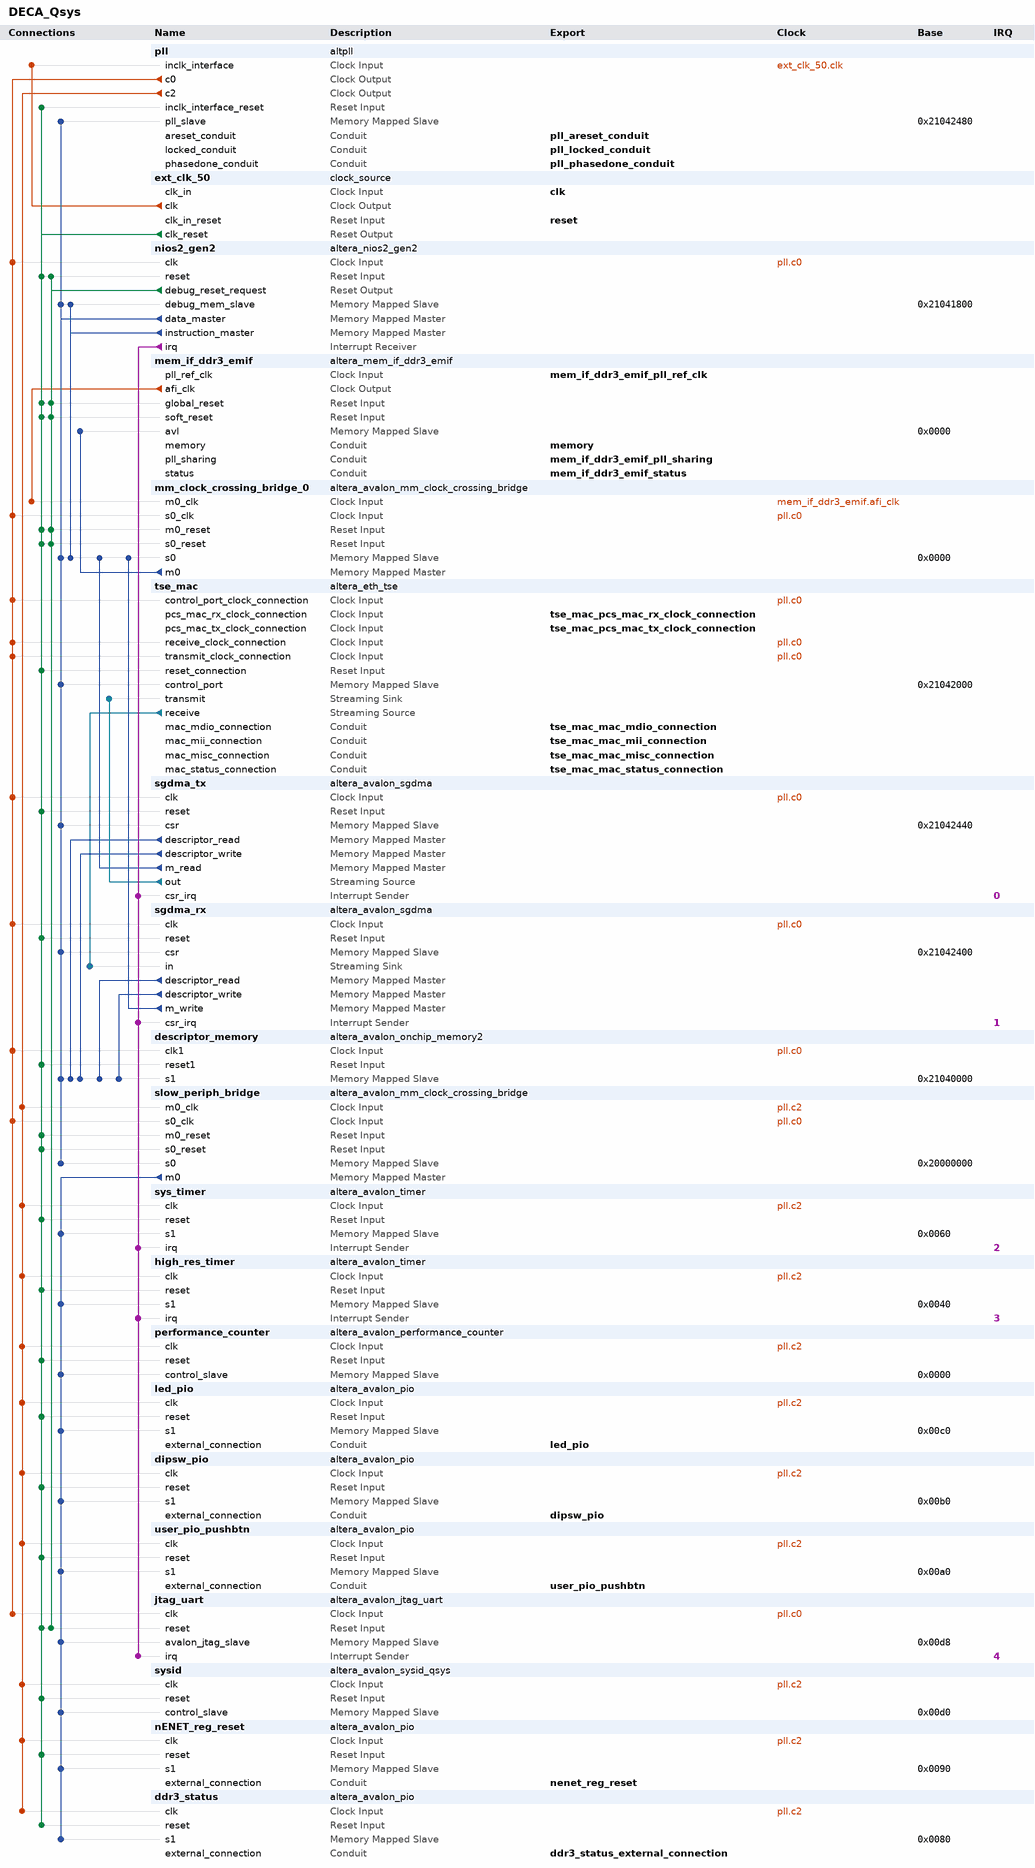
[diagram p0: system contents]
# Platform Designer (Qsys) system DECA_Qsys, MAX 10 10M50DAF484C6GES
# Parameters at their usual value, and those the tool derives, are not listed.
package require -exact qsys 15.0
create_system DECA_Qsys
set_project_property DEVICE_FAMILY {MAX 10}
set_project_property DEVICE 10M50DAF484C6GES

add_instance pll altpll 15.0
set_instance_parameter_value pll CLK0_DIVIDE_BY 1
set_instance_parameter_value pll CLK0_MULTIPLY_BY 2
set_instance_parameter_value pll CLK1_DIVIDE_BY 5
set_instance_parameter_value pll CLK1_DUTY_CYCLE 50
set_instance_parameter_value pll CLK1_MULTIPLY_BY 6
set_instance_parameter_value pll CLK1_PHASE_SHIFT 0
set_instance_parameter_value pll CLK2_DIVIDE_BY 5
set_instance_parameter_value pll CLK2_DUTY_CYCLE 50
set_instance_parameter_value pll CLK2_MULTIPLY_BY 4
set_instance_parameter_value pll CLK2_PHASE_SHIFT 0
set_instance_parameter_value pll CLK3_DIVIDE_BY 2
set_instance_parameter_value pll CLK3_DUTY_CYCLE 50
set_instance_parameter_value pll CLK3_MULTIPLY_BY 1
set_instance_parameter_value pll CLK3_PHASE_SHIFT 0
set_instance_parameter_value pll INCLK0_INPUT_FREQUENCY 20000
set_instance_parameter_value pll PORT_ARESET PORT_USED
set_instance_parameter_value pll PORT_LOCKED PORT_USED
set_instance_parameter_value pll PORT_clk1 PORT_USED
set_instance_parameter_value pll PORT_clk2 PORT_USED
set_instance_parameter_value pll PORT_clk3 PORT_USED

add_instance ext_clk_50 clock_source 15.0
set_instance_parameter_value ext_clk_50 clockFrequency 50000000
set_instance_parameter_value ext_clk_50 resetSynchronousEdges BOTH

add_instance nios2_gen2 altera_nios2_gen2 15.0
set_instance_parameter_value nios2_gen2 dcache_size 2048
set_instance_parameter_value nios2_gen2 exceptionSlave mem_if_ddr3_emif.avl
set_instance_parameter_value nios2_gen2 icache_size 4096
set_instance_parameter_value nios2_gen2 impl Fast
set_instance_parameter_value nios2_gen2 resetSlave mem_if_ddr3_emif.avl

add_instance mem_if_ddr3_emif altera_mem_if_ddr3_emif 15.0
set_instance_parameter_value mem_if_ddr3_emif AVL_MAX_SIZE 4
set_instance_parameter_value mem_if_ddr3_emif CALIBRATION_MODE Skip
set_instance_parameter_value mem_if_ddr3_emif CPORT_TYPE_PORT Bidirectional,Bidirectional,Bidirectional,Bidirectional,Bidirectional,Bidirectional
set_instance_parameter_value mem_if_ddr3_emif EXPORT_AFI_HALF_CLK false
set_instance_parameter_value mem_if_ddr3_emif HARD_EMIF false
set_instance_parameter_value mem_if_ddr3_emif MEM_BANKADDR_WIDTH 3
set_instance_parameter_value mem_if_ddr3_emif MEM_CLK_FREQ 300.0
set_instance_parameter_value mem_if_ddr3_emif MEM_CLK_FREQ_MAX 800.0
set_instance_parameter_value mem_if_ddr3_emif MEM_COL_ADDR_WIDTH 10
set_instance_parameter_value mem_if_ddr3_emif MEM_DQ_WIDTH 16
set_instance_parameter_value mem_if_ddr3_emif MEM_FORMAT DISCRETE
set_instance_parameter_value mem_if_ddr3_emif MEM_ROW_ADDR_WIDTH 15
set_instance_parameter_value mem_if_ddr3_emif MEM_TCL 7
set_instance_parameter_value mem_if_ddr3_emif MEM_TFAW_NS 45.0
set_instance_parameter_value mem_if_ddr3_emif MEM_TRAS_NS 35.0
set_instance_parameter_value mem_if_ddr3_emif MEM_TRCD_NS 13.75
set_instance_parameter_value mem_if_ddr3_emif MEM_TRFC_NS 260.0
set_instance_parameter_value mem_if_ddr3_emif MEM_TRP_NS 13.75
set_instance_parameter_value mem_if_ddr3_emif MEM_TRRD_NS 7.5
set_instance_parameter_value mem_if_ddr3_emif MEM_TRTP_NS 7.5
set_instance_parameter_value mem_if_ddr3_emif MEM_TWTR 6
set_instance_parameter_value mem_if_ddr3_emif MEM_VENDOR Micron
set_instance_parameter_value mem_if_ddr3_emif MEM_WTCL 6
set_instance_parameter_value mem_if_ddr3_emif PLL_LOCATION Top_Bottom
set_instance_parameter_value mem_if_ddr3_emif POWER_OF_TWO_BUS true
set_instance_parameter_value mem_if_ddr3_emif PRIORITY_PORT 1,1,1,1,1,1
set_instance_parameter_value mem_if_ddr3_emif RATE Half
set_instance_parameter_value mem_if_ddr3_emif REF_CLK_FREQ 50.0
set_instance_parameter_value mem_if_ddr3_emif SPEED_GRADE 6
set_instance_parameter_value mem_if_ddr3_emif TIMING_BOARD_AC_SKEW 0.017
set_instance_parameter_value mem_if_ddr3_emif TIMING_BOARD_AC_TO_CK_SKEW -1.3E-4
set_instance_parameter_value mem_if_ddr3_emif TIMING_BOARD_DQ_TO_DQS_SKEW -6.0E-4
set_instance_parameter_value mem_if_ddr3_emif TIMING_BOARD_MAX_CK_DELAY 0.183
set_instance_parameter_value mem_if_ddr3_emif TIMING_BOARD_MAX_DQS_DELAY 0.181
set_instance_parameter_value mem_if_ddr3_emif TIMING_BOARD_SKEW_BETWEEN_DQS 0.005
set_instance_parameter_value mem_if_ddr3_emif TIMING_BOARD_SKEW_CKDQS_DIMM_MAX 0.007
set_instance_parameter_value mem_if_ddr3_emif TIMING_BOARD_SKEW_CKDQS_DIMM_MIN 0.002
set_instance_parameter_value mem_if_ddr3_emif TIMING_BOARD_SKEW_WITHIN_DQS 0.008
set_instance_parameter_value mem_if_ddr3_emif TIMING_TDH 55
set_instance_parameter_value mem_if_ddr3_emif TIMING_TDQSCK 225
set_instance_parameter_value mem_if_ddr3_emif TIMING_TDQSQ 125
set_instance_parameter_value mem_if_ddr3_emif TIMING_TDQSS 0.25
set_instance_parameter_value mem_if_ddr3_emif TIMING_TDS 55
set_instance_parameter_value mem_if_ddr3_emif TIMING_TDSH 0.2
set_instance_parameter_value mem_if_ddr3_emif TIMING_TDSS 0.2
set_instance_parameter_value mem_if_ddr3_emif TIMING_TIH 130
set_instance_parameter_value mem_if_ddr3_emif TIMING_TIS 185
set_instance_parameter_value mem_if_ddr3_emif TIMING_TQSH 0.4
set_instance_parameter_value mem_if_ddr3_emif USER_DEBUG_LEVEL 1

add_instance mm_clock_crossing_bridge_0 altera_avalon_mm_clock_crossing_bridge 15.0
set_instance_parameter_value mm_clock_crossing_bridge_0 ADDRESS_WIDTH 10
set_instance_parameter_value mm_clock_crossing_bridge_0 COMMAND_FIFO_DEPTH 16
set_instance_parameter_value mm_clock_crossing_bridge_0 DATA_WIDTH 32
set_instance_parameter_value mm_clock_crossing_bridge_0 MASTER_SYNC_DEPTH 2
set_instance_parameter_value mm_clock_crossing_bridge_0 MAX_BURST_SIZE 1
set_instance_parameter_value mm_clock_crossing_bridge_0 RESPONSE_FIFO_DEPTH 16
set_instance_parameter_value mm_clock_crossing_bridge_0 SLAVE_SYNC_DEPTH 2
set_instance_parameter_value mm_clock_crossing_bridge_0 USE_AUTO_ADDRESS_WIDTH 1

add_instance tse_mac altera_eth_tse 15.0
set_instance_parameter_value tse_mac core_variation SMALL_MAC_10_100
set_instance_parameter_value tse_mac enable_hd_logic true
set_instance_parameter_value tse_mac enable_mac_flow_ctrl false
set_instance_parameter_value tse_mac enable_magic_detect false
set_instance_parameter_value tse_mac enable_shift16 true
set_instance_parameter_value tse_mac ifGMII MII
set_instance_parameter_value tse_mac ing_addr 11
set_instance_parameter_value tse_mac mdio_clk_div 40
set_instance_parameter_value tse_mac stat_cnt_ena false
set_instance_parameter_value tse_mac transceiver_type NONE

add_instance sgdma_tx altera_avalon_sgdma 15.0
set_instance_parameter_value sgdma_tx enableBurstTransfers false
set_instance_parameter_value sgdma_tx enableUnalignedTransfers false
set_instance_parameter_value sgdma_tx readBlockDataWidth 32
set_instance_parameter_value sgdma_tx sinkErrorWidth 0
set_instance_parameter_value sgdma_tx sourceErrorWidth 1
set_instance_parameter_value sgdma_tx transferMode MEMORY_TO_STREAM
set_instance_parameter_value sgdma_tx writeBurstcountWidth 4

add_instance sgdma_rx altera_avalon_sgdma 15.0
set_instance_parameter_value sgdma_rx enableBurstTransfers false
set_instance_parameter_value sgdma_rx enableUnalignedTransfers false
set_instance_parameter_value sgdma_rx readBlockDataWidth 32
set_instance_parameter_value sgdma_rx sinkErrorWidth 6
set_instance_parameter_value sgdma_rx sourceErrorWidth 0
set_instance_parameter_value sgdma_rx transferMode STREAM_TO_MEMORY
set_instance_parameter_value sgdma_rx writeBurstcountWidth 4

add_instance descriptor_memory altera_avalon_onchip_memory2 15.0
set_instance_parameter_value descriptor_memory dataWidth 32
set_instance_parameter_value descriptor_memory dualPort false
set_instance_parameter_value descriptor_memory initMemContent false
set_instance_parameter_value descriptor_memory initializationFileName descriptor_memory
set_instance_parameter_value descriptor_memory memorySize 4096

add_instance slow_periph_bridge altera_avalon_mm_clock_crossing_bridge 15.0
set_instance_parameter_value slow_periph_bridge ADDRESS_WIDTH 10
set_instance_parameter_value slow_periph_bridge COMMAND_FIFO_DEPTH 4
set_instance_parameter_value slow_periph_bridge DATA_WIDTH 32
set_instance_parameter_value slow_periph_bridge MASTER_SYNC_DEPTH 2
set_instance_parameter_value slow_periph_bridge MAX_BURST_SIZE 1
set_instance_parameter_value slow_periph_bridge RESPONSE_FIFO_DEPTH 4
set_instance_parameter_value slow_periph_bridge SLAVE_SYNC_DEPTH 2
set_instance_parameter_value slow_periph_bridge USE_AUTO_ADDRESS_WIDTH 0

add_instance sys_timer altera_avalon_timer 15.0
set_instance_parameter_value sys_timer period 10
set_instance_parameter_value sys_timer periodUnits MSEC

add_instance high_res_timer altera_avalon_timer 15.0
set_instance_parameter_value high_res_timer period 1
set_instance_parameter_value high_res_timer periodUnits USEC

add_instance performance_counter altera_avalon_performance_counter 15.0
set_instance_parameter_value performance_counter numberOfSections 3

add_instance led_pio altera_avalon_pio 15.0
set_instance_parameter_value led_pio direction Output
set_instance_parameter_value led_pio width 8

add_instance dipsw_pio altera_avalon_pio 15.0
set_instance_parameter_value dipsw_pio captureEdge true
set_instance_parameter_value dipsw_pio direction Input
set_instance_parameter_value dipsw_pio edgeType ANY
set_instance_parameter_value dipsw_pio simDoTestBenchWiring true
set_instance_parameter_value dipsw_pio simDrivenValue 3
set_instance_parameter_value dipsw_pio width 2

add_instance user_pio_pushbtn altera_avalon_pio 15.0
set_instance_parameter_value user_pio_pushbtn direction Input
set_instance_parameter_value user_pio_pushbtn edgeType FALLING
set_instance_parameter_value user_pio_pushbtn simDoTestBenchWiring true
set_instance_parameter_value user_pio_pushbtn simDrivenValue 1
set_instance_parameter_value user_pio_pushbtn width 1

add_instance jtag_uart altera_avalon_jtag_uart 15.0
set_instance_parameter_value jtag_uart simInteractiveOptions INTERACTIVE_ASCII_OUTPUT

add_instance sysid altera_avalon_sysid_qsys 15.0
set_instance_parameter_value sysid id 0

add_instance nENET_reg_reset altera_avalon_pio 15.0
set_instance_parameter_value nENET_reg_reset direction Output
set_instance_parameter_value nENET_reg_reset resetValue 1
set_instance_parameter_value nENET_reg_reset width 1

add_instance ddr3_status altera_avalon_pio 15.0
set_instance_parameter_value ddr3_status direction Input
set_instance_parameter_value ddr3_status width 3

# connections
add_connection ext_clk_50.clk pll.inclk_interface clock
add_connection mem_if_ddr3_emif.afi_clk mm_clock_crossing_bridge_0.m0_clk clock
add_connection pll.c0 descriptor_memory.clk1 clock
add_connection pll.c0 jtag_uart.clk clock
add_connection pll.c0 mm_clock_crossing_bridge_0.s0_clk clock
add_connection pll.c0 nios2_gen2.clk clock
add_connection pll.c0 sgdma_rx.clk clock
add_connection pll.c0 sgdma_tx.clk clock
add_connection pll.c0 slow_periph_bridge.s0_clk clock
add_connection pll.c0 tse_mac.control_port_clock_connection clock
add_connection pll.c0 tse_mac.receive_clock_connection clock
add_connection pll.c0 tse_mac.transmit_clock_connection clock
add_connection pll.c2 ddr3_status.clk clock
add_connection pll.c2 dipsw_pio.clk clock
add_connection pll.c2 high_res_timer.clk clock
add_connection pll.c2 led_pio.clk clock
add_connection pll.c2 nENET_reg_reset.clk clock
add_connection pll.c2 performance_counter.clk clock
add_connection pll.c2 slow_periph_bridge.m0_clk clock
add_connection pll.c2 sys_timer.clk clock
add_connection pll.c2 sysid.clk clock
add_connection pll.c2 user_pio_pushbtn.clk clock
add_connection ext_clk_50.clk_reset ddr3_status.reset reset
add_connection ext_clk_50.clk_reset descriptor_memory.reset1 reset
add_connection ext_clk_50.clk_reset dipsw_pio.reset reset
add_connection ext_clk_50.clk_reset high_res_timer.reset reset
add_connection ext_clk_50.clk_reset jtag_uart.reset reset
add_connection ext_clk_50.clk_reset led_pio.reset reset
add_connection ext_clk_50.clk_reset mem_if_ddr3_emif.global_reset reset
add_connection ext_clk_50.clk_reset mem_if_ddr3_emif.soft_reset reset
add_connection ext_clk_50.clk_reset mm_clock_crossing_bridge_0.m0_reset reset
add_connection ext_clk_50.clk_reset mm_clock_crossing_bridge_0.s0_reset reset
add_connection ext_clk_50.clk_reset nENET_reg_reset.reset reset
add_connection ext_clk_50.clk_reset nios2_gen2.reset reset
add_connection ext_clk_50.clk_reset performance_counter.reset reset
add_connection ext_clk_50.clk_reset pll.inclk_interface_reset reset
add_connection ext_clk_50.clk_reset sgdma_rx.reset reset
add_connection ext_clk_50.clk_reset sgdma_tx.reset reset
add_connection ext_clk_50.clk_reset slow_periph_bridge.m0_reset reset
add_connection ext_clk_50.clk_reset slow_periph_bridge.s0_reset reset
add_connection ext_clk_50.clk_reset sys_timer.reset reset
add_connection ext_clk_50.clk_reset sysid.reset reset
add_connection ext_clk_50.clk_reset tse_mac.reset_connection reset
add_connection ext_clk_50.clk_reset user_pio_pushbtn.reset reset
add_connection nios2_gen2.debug_reset_request jtag_uart.reset reset
add_connection nios2_gen2.debug_reset_request mem_if_ddr3_emif.global_reset reset
add_connection nios2_gen2.debug_reset_request mem_if_ddr3_emif.soft_reset reset
add_connection nios2_gen2.debug_reset_request mm_clock_crossing_bridge_0.m0_reset reset
add_connection nios2_gen2.debug_reset_request mm_clock_crossing_bridge_0.s0_reset reset
add_connection nios2_gen2.debug_reset_request nios2_gen2.reset reset
add_connection mm_clock_crossing_bridge_0.m0 mem_if_ddr3_emif.avl avalon
set_connection_parameter_value mm_clock_crossing_bridge_0.m0/mem_if_ddr3_emif.avl baseAddress 0x0000
add_connection nios2_gen2.data_master descriptor_memory.s1 avalon
set_connection_parameter_value nios2_gen2.data_master/descriptor_memory.s1 baseAddress 0x21040000
add_connection nios2_gen2.data_master mm_clock_crossing_bridge_0.s0 avalon
set_connection_parameter_value nios2_gen2.data_master/mm_clock_crossing_bridge_0.s0 baseAddress 0x0000
add_connection nios2_gen2.data_master nios2_gen2.debug_mem_slave avalon
set_connection_parameter_value nios2_gen2.data_master/nios2_gen2.debug_mem_slave baseAddress 0x21041800
add_connection nios2_gen2.data_master pll.pll_slave avalon
set_connection_parameter_value nios2_gen2.data_master/pll.pll_slave baseAddress 0x21042480
add_connection nios2_gen2.data_master sgdma_rx.csr avalon
set_connection_parameter_value nios2_gen2.data_master/sgdma_rx.csr baseAddress 0x21042400
add_connection nios2_gen2.data_master sgdma_tx.csr avalon
set_connection_parameter_value nios2_gen2.data_master/sgdma_tx.csr baseAddress 0x21042440
add_connection nios2_gen2.data_master slow_periph_bridge.s0 avalon
set_connection_parameter_value nios2_gen2.data_master/slow_periph_bridge.s0 baseAddress 0x20000000
add_connection nios2_gen2.data_master tse_mac.control_port avalon
set_connection_parameter_value nios2_gen2.data_master/tse_mac.control_port baseAddress 0x21042000
add_connection nios2_gen2.instruction_master mm_clock_crossing_bridge_0.s0 avalon
set_connection_parameter_value nios2_gen2.instruction_master/mm_clock_crossing_bridge_0.s0 baseAddress 0x0000
add_connection nios2_gen2.instruction_master nios2_gen2.debug_mem_slave avalon
set_connection_parameter_value nios2_gen2.instruction_master/nios2_gen2.debug_mem_slave baseAddress 0x21041800
add_connection sgdma_rx.descriptor_read descriptor_memory.s1 avalon
set_connection_parameter_value sgdma_rx.descriptor_read/descriptor_memory.s1 baseAddress 0x21040000
add_connection sgdma_rx.descriptor_write descriptor_memory.s1 avalon
set_connection_parameter_value sgdma_rx.descriptor_write/descriptor_memory.s1 baseAddress 0x21040000
add_connection sgdma_rx.m_write mm_clock_crossing_bridge_0.s0 avalon
set_connection_parameter_value sgdma_rx.m_write/mm_clock_crossing_bridge_0.s0 baseAddress 0x0000
add_connection sgdma_tx.descriptor_read descriptor_memory.s1 avalon
set_connection_parameter_value sgdma_tx.descriptor_read/descriptor_memory.s1 baseAddress 0x21040000
add_connection sgdma_tx.descriptor_write descriptor_memory.s1 avalon
set_connection_parameter_value sgdma_tx.descriptor_write/descriptor_memory.s1 baseAddress 0x21040000
add_connection sgdma_tx.m_read mm_clock_crossing_bridge_0.s0 avalon
set_connection_parameter_value sgdma_tx.m_read/mm_clock_crossing_bridge_0.s0 baseAddress 0x0000
add_connection slow_periph_bridge.m0 ddr3_status.s1 avalon
set_connection_parameter_value slow_periph_bridge.m0/ddr3_status.s1 baseAddress 0x0080
add_connection slow_periph_bridge.m0 dipsw_pio.s1 avalon
set_connection_parameter_value slow_periph_bridge.m0/dipsw_pio.s1 baseAddress 0x00b0
add_connection slow_periph_bridge.m0 high_res_timer.s1 avalon
set_connection_parameter_value slow_periph_bridge.m0/high_res_timer.s1 baseAddress 0x0040
add_connection slow_periph_bridge.m0 jtag_uart.avalon_jtag_slave avalon
set_connection_parameter_value slow_periph_bridge.m0/jtag_uart.avalon_jtag_slave baseAddress 0x00d8
add_connection slow_periph_bridge.m0 led_pio.s1 avalon
set_connection_parameter_value slow_periph_bridge.m0/led_pio.s1 baseAddress 0x00c0
add_connection slow_periph_bridge.m0 nENET_reg_reset.s1 avalon
set_connection_parameter_value slow_periph_bridge.m0/nENET_reg_reset.s1 baseAddress 0x0090
add_connection slow_periph_bridge.m0 performance_counter.control_slave avalon
set_connection_parameter_value slow_periph_bridge.m0/performance_counter.control_slave baseAddress 0x0000
add_connection slow_periph_bridge.m0 sys_timer.s1 avalon
set_connection_parameter_value slow_periph_bridge.m0/sys_timer.s1 baseAddress 0x0060
add_connection slow_periph_bridge.m0 sysid.control_slave avalon
set_connection_parameter_value slow_periph_bridge.m0/sysid.control_slave baseAddress 0x00d0
add_connection slow_periph_bridge.m0 user_pio_pushbtn.s1 avalon
set_connection_parameter_value slow_periph_bridge.m0/user_pio_pushbtn.s1 baseAddress 0x00a0
add_connection sgdma_tx.out tse_mac.transmit avalon_streaming
add_connection tse_mac.receive sgdma_rx.in avalon_streaming
add_connection nios2_gen2.irq high_res_timer.irq interrupt
set_connection_parameter_value nios2_gen2.irq/high_res_timer.irq irqNumber 3
add_connection nios2_gen2.irq jtag_uart.irq interrupt
set_connection_parameter_value nios2_gen2.irq/jtag_uart.irq irqNumber 4
add_connection nios2_gen2.irq sgdma_rx.csr_irq interrupt
set_connection_parameter_value nios2_gen2.irq/sgdma_rx.csr_irq irqNumber 1
add_connection nios2_gen2.irq sgdma_tx.csr_irq interrupt
set_connection_parameter_value nios2_gen2.irq/sgdma_tx.csr_irq irqNumber 0
add_connection nios2_gen2.irq sys_timer.irq interrupt
set_connection_parameter_value nios2_gen2.irq/sys_timer.irq irqNumber 2

# exported interfaces
add_interface clk clock sink
set_interface_property clk EXPORT_OF ext_clk_50.clk_in
add_interface ddr3_status_external_connection conduit end
set_interface_property ddr3_status_external_connection EXPORT_OF ddr3_status.external_connection
add_interface dipsw_pio conduit end
set_interface_property dipsw_pio EXPORT_OF dipsw_pio.external_connection
add_interface led_pio conduit end
set_interface_property led_pio EXPORT_OF led_pio.external_connection
add_interface mem_if_ddr3_emif_pll_ref_clk clock sink
set_interface_property mem_if_ddr3_emif_pll_ref_clk EXPORT_OF mem_if_ddr3_emif.pll_ref_clk
add_interface mem_if_ddr3_emif_pll_sharing conduit end
set_interface_property mem_if_ddr3_emif_pll_sharing EXPORT_OF mem_if_ddr3_emif.pll_sharing
add_interface mem_if_ddr3_emif_status conduit end
set_interface_property mem_if_ddr3_emif_status EXPORT_OF mem_if_ddr3_emif.status
add_interface memory conduit end
set_interface_property memory EXPORT_OF mem_if_ddr3_emif.memory
add_interface nenet_reg_reset conduit end
set_interface_property nenet_reg_reset EXPORT_OF nENET_reg_reset.external_connection
add_interface pll_areset_conduit conduit end
set_interface_property pll_areset_conduit EXPORT_OF pll.areset_conduit
add_interface pll_locked_conduit conduit end
set_interface_property pll_locked_conduit EXPORT_OF pll.locked_conduit
add_interface pll_phasedone_conduit conduit end
set_interface_property pll_phasedone_conduit EXPORT_OF pll.phasedone_conduit
add_interface reset reset sink
set_interface_property reset EXPORT_OF ext_clk_50.clk_in_reset
add_interface tse_mac_mac_mdio_connection conduit end
set_interface_property tse_mac_mac_mdio_connection EXPORT_OF tse_mac.mac_mdio_connection
add_interface tse_mac_mac_mii_connection conduit end
set_interface_property tse_mac_mac_mii_connection EXPORT_OF tse_mac.mac_mii_connection
add_interface tse_mac_mac_misc_connection conduit end
set_interface_property tse_mac_mac_misc_connection EXPORT_OF tse_mac.mac_misc_connection
add_interface tse_mac_mac_status_connection conduit end
set_interface_property tse_mac_mac_status_connection EXPORT_OF tse_mac.mac_status_connection
add_interface tse_mac_pcs_mac_rx_clock_connection clock sink
set_interface_property tse_mac_pcs_mac_rx_clock_connection EXPORT_OF tse_mac.pcs_mac_rx_clock_connection
add_interface tse_mac_pcs_mac_tx_clock_connection clock sink
set_interface_property tse_mac_pcs_mac_tx_clock_connection EXPORT_OF tse_mac.pcs_mac_tx_clock_connection
add_interface user_pio_pushbtn conduit end
set_interface_property user_pio_pushbtn EXPORT_OF user_pio_pushbtn.external_connection

set_interconnect_requirement {$system} qsys_mm.clockCrossingAdapter HANDSHAKE
set_interconnect_requirement {$system} qsys_mm.maxAdditionalLatency 1

save_system DECA_Qsys.qsys
